# EAGLE design basic-inline-turbidimeter_power_board (EAGLE 7.7.0)
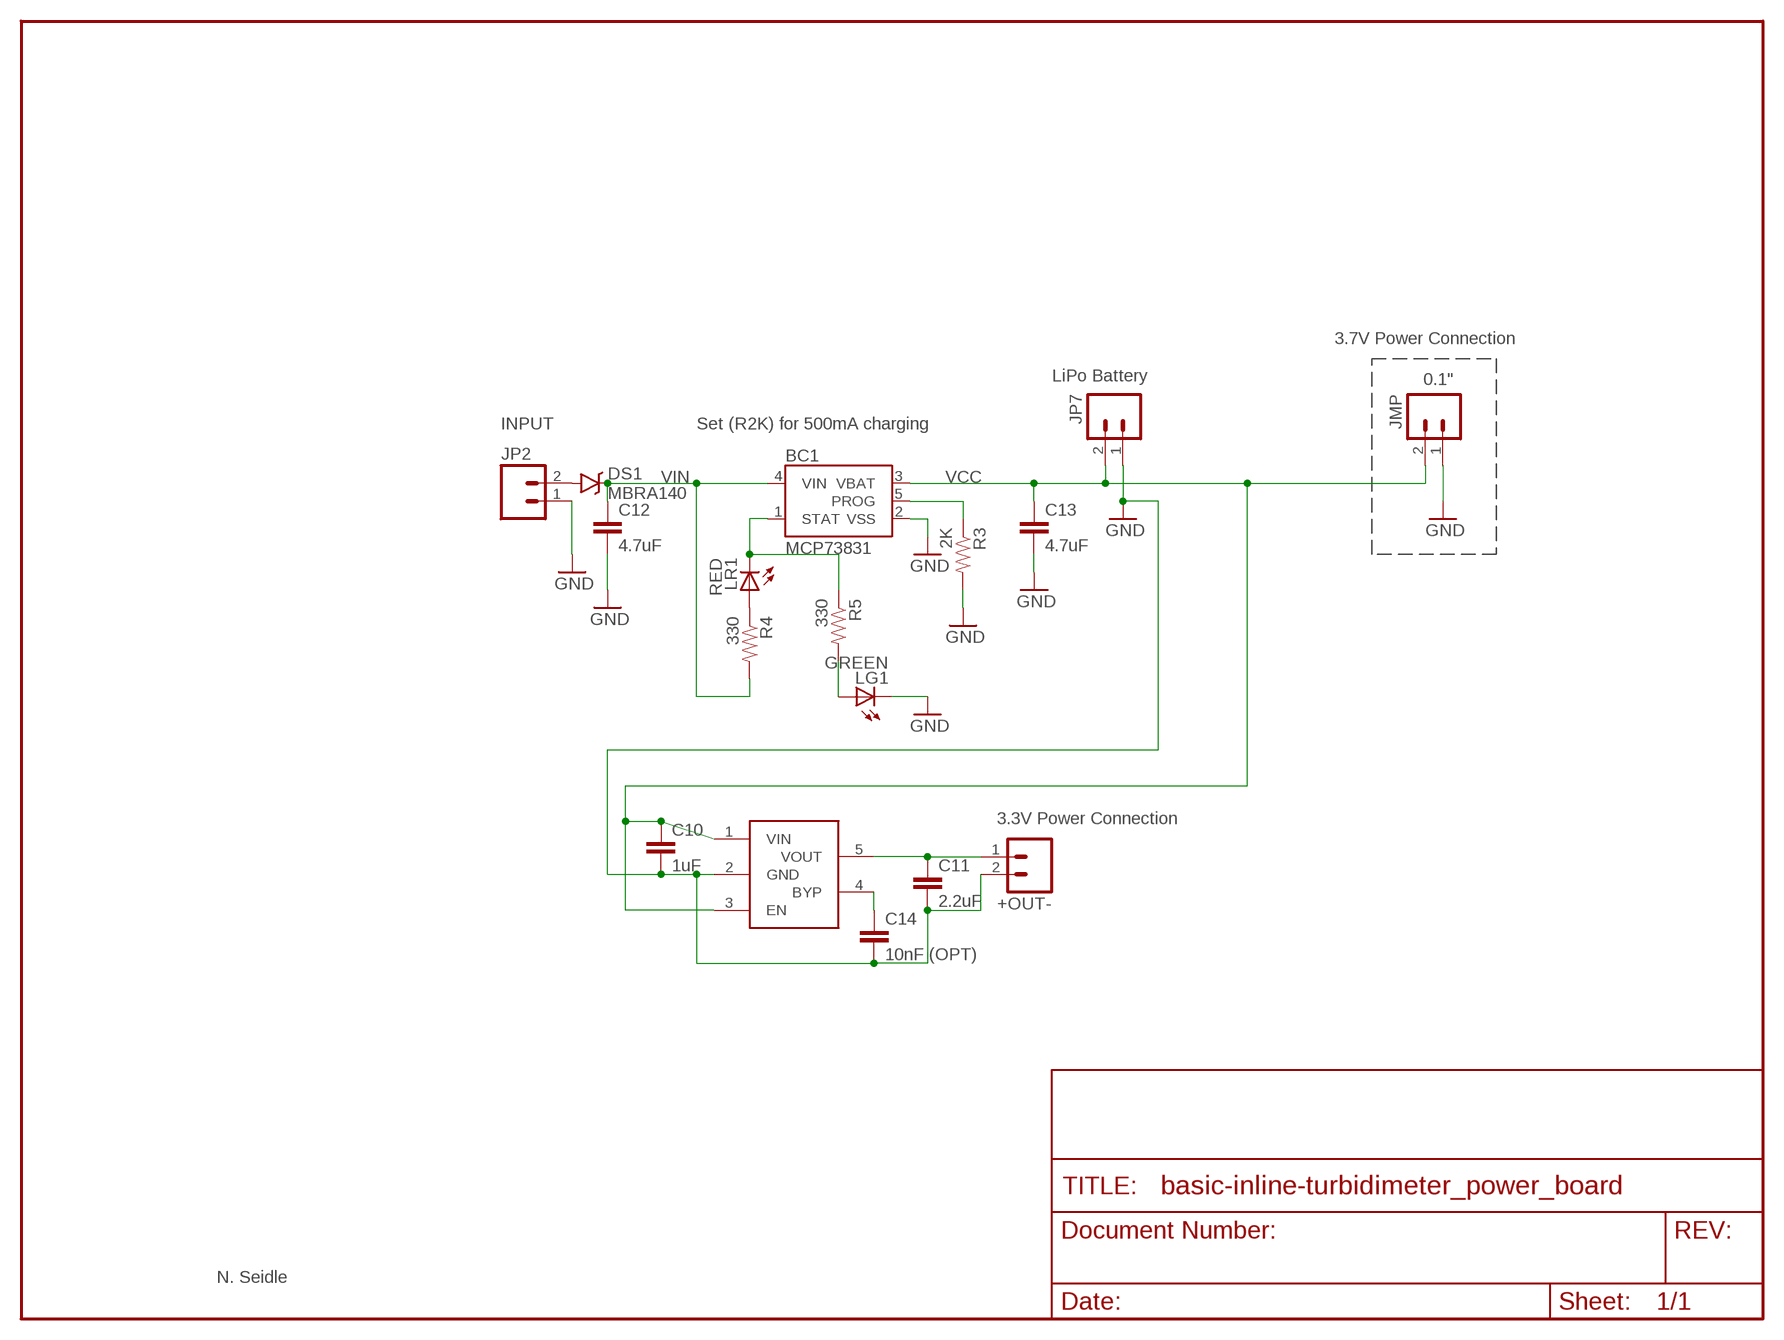
[diagram p0: schematic, sheet 1]

## Parts
+OUT-  M02PTH  [1X02]
BC1  MCP73831  [SOT23-5]
C10  1uF  CAP0603-CAP  [0603-CAP]
C11  2.2uF  CAP0603-CAP  [0603-CAP]
C12  4.7uF  CAP0402-CAP  [0402-CAP]
C13  4.7uF  CAP0402-CAP  [0402-CAP]
C14  10nF (OPT)  CAP0603-CAP  [0603-CAP]
DS1  MBRA140  [SMA-DIODE]
JMP  M02PTH  [1X02]
JP2  M02PTH  [1X02]
JP7  LiPo Battery  M02-JST-2MM-SMT  [JST-2-SMD]
LG1  GREEN  LED0603  [LED-0603]
LR1  RED  LED0603  [LED-0603]
R3  2K  RESISTOR0402-RES  [0402-RES]
R4  330  RESISTOR0402-RES  [0402-RES]
R5  330  RESISTOR0402-RES  [0402-RES]
VR1  LP2985  [LP2985]

## Nets
GND: +OUT-.2 BC1.2(VSS) C10.2 C11.2 C12.2 C13.2 C14.2 JMP.1 JP2.1 JP7.1 LG1.C R3.2 VR1.2(GND)
N$1: C14.1 VR1.4(BYP)
N$2: LG1.A R5.2
N$3: LR1.A R4.1
N$4: +OUT-.1 C11.1 VR1.5(VOUT)
N$5: DS1.A JP2.2
PROG: BC1.5(PROG) R3.1
STAT: BC1.1(STAT) LR1.C R5.1
VCC: BC1.3(VBAT) C10.1 C13.1 JMP.2 JP7.2 VR1.1(VIN) VR1.3(EN)
VIN: BC1.4(VIN) C12.1 DS1.C R4.2

## Notes on the sheet
- 3.7V Power Connection
- 0.1"
- INPUT | Set (R2K) for 500mA charging
- 3.3V Power Connection
- N. Seidle

## Library data of the parts
+OUT- JP2 = SparkFun-Connectors:M02: Standard 2-pin 0.1" header. Use with - straight break away headers ( PRT-00116) - right angle break away headers (PRT-00553) - swiss pins (PRT-00743) - machine pins (PRT-00117) - female headers (PRT-00115) Molex polarized connector foot print use with: PRT-08233 with associated crimp pins and housings. 2.54_SCREWTERM for use with PRT-10571. 3.5mm Screw Terminal footprints for PRT-08084 5mm Screw Terminal footprints for use with PRT-08432
BC1 = SparkFun:MCP73831: Microchip's MCP73831 Miniature single cell, fully integrated Li-Ion, Li-polymer charge management controller http://ww1.microchip.com/downloads/en/DeviceDoc/21984a.pdf
C10 C11 C14 = SparkFun-Passives:CAP: Capacitor Standard 0603 ceramic capacitor, and 0.1" leaded capacitor.
C12 C13 = SparkFun:CAP: Capacitor Standard 0603 ceramic capacitor, and 0.1" leaded capacitor.
DS1 = SparkFun-DiscreteSemi:MBRA140: 40V, 1A Schottky rectifier SMA/DO-214AC package DIO-08053; PROD_ID: DIO-08053
JMP JP7 = SparkFun:M02: Header 2 Standard 2-pin 0.1" header. Use with straight break away headers (SKU : PRT-00116), right angle break away headers (PRT-00553), swiss pins (PRT-00743), machine pins (PRT-00117), and female headers (PRT-00115). Molex polarized connector foot print use with SKU : PRT-08233 with associated crimp pins and housings.
LG1 LR1 = SparkFun:LED: LEDs Standard schematic elements and footprints for 5mm, 3mm, 1206, and 0603 sized LEDs. 5mm - Spark Fun Electronics SKU : COM-00529 (and others)
R3-R5 = SparkFun:RESISTOR: Resistor Basic schematic elements and footprints for 0603, 1206, and PTH resistors.
VR1 = awqua_eagle_library:LP2985

## Board
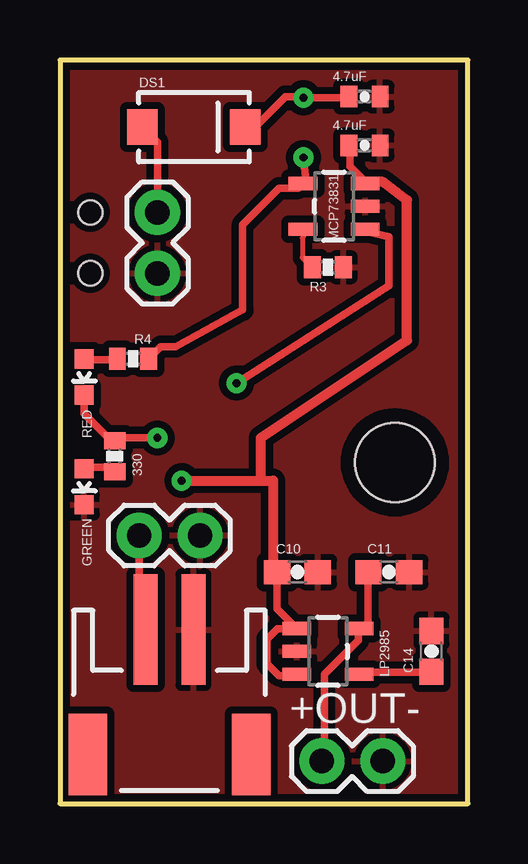
[diagram p1: board, top side]
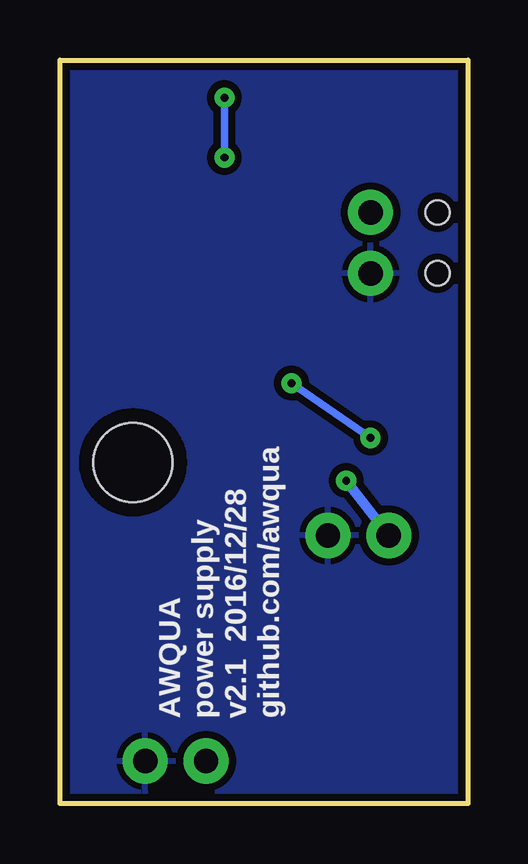
[diagram p2: board, bottom side, seen from below]

Size 17.02 x 30.99 mm. Coordinates in mm from the lower left corner, seen from the top.
Outline: 17.02,0 17.02,30.99 0,30.99 0,0 17.02,0
Copper layers (1*16): Top 0.035mm / dielectric 1.5mm / Bottom 0.035mm
Design rules "SparkFun": minimum track width 8mil, minimum drill 20mil, track to track 8mil, track to pad 8mil, pad to pad 8mil, via to via 8mil, smd to smd 6mil, copper to edge 8mil, drill to drill 8mil, minimum pad ring 12mil, minimum via ring 10mil, stop-mask expansion 4mil, vias tented up to drill 25mil, thermal gap 10mil
Holes 1.02 mm at 1.27,24.64 1.27,22.1

### Footprints (pad centres in the part's own frame; a part is rotated, then mirrored left to right if it is on the bottom)
1X02 = drill 1.016 pad 1.88: 1 0,0; 2 2.54,0
SOT23-5 = smd 0.55 x 1.2: 1 -0.95,-1.3; 2 0,-1.3; 3 0.95,-1.3; 4 0.95,1.3; 5 -0.95,1.3
0603-CAP = smd 1.1 x 1: 1 -0.85,0; 2 0.85,0
0402-CAP = smd 0.7 x 0.9: 1 -0.65,0; 2 0.65,0
SMA-DIODE = smd 1.27 x 1.47: A -2.15,0; C 2.15,0
STAND-OFF = hole 3.302: 0,0
JST-2-SMD = smd 1 x 4.6: 1 -1,-3.7; 2 1,-3.7 | smd 1.6 x 3.4: NC1 -3.4,1.5; NC2 3.4,1.5
LED-0603 = smd 0.8 x 0.8: A 0,-0.75; C 0,0.75
0402-RES = smd 0.7 x 0.9: 1 -0.65,0; 2 0.65,0
LP2985 = smd 0.55 x 1.2: 1 0.32,-0.03; 2 1.27,-0.03; 3 2.22,-0.03; 4 2.22,2.57; 5 0.32,2.57

### Placement (x,y rotation side)
+OUT-  10.92,1.78 0 top
BC1  11.43,24.89 90 top
C10  9.91,9.65 0 top
C11  13.72,9.65 0 top
C12  12.7,29.46 0 top
C13  12.7,27.43 0 top
C14  15.49,6.35 90 top
DS1  5.59,28.19 0 top
JMP  5.84,11.18 180 top
JP1  STAND-OFF  [STAND-OFF]  13.97,14.22 0 top
JP2  4.06,22.1 90 top
JP7  4.57,3.56 180 top
LG1  1.02,13.21 180 top
LR1  1.02,17.78 180 top
R3  11.18,22.35 0 top
R4  3.05,18.54 0 top
R5  2.29,14.48 270 top
VR1  9.91,7.62 270 top

### Tracks (layer width: path | path; a pad name or v marks a point on that pad's centre or on a via)
GND
  pour Bottom (isolate 0.305): -2.79,-1.52 -3.05,31.5 29.46,31.24 29.46,-0.25
  pour Top (isolate 0.305): -3.56,31.75 28.96,31.24 28.96,-0.51 -3.3,-1.02
N$1
  Top 0.203: 15.49,5.49 C14.1 | 12.65,5.49 VR1.4
  Top 0.305: 12.65,5.49 15.49,5.49
N$2
  Top 0.203: 1.07,14.02 LG1.A | 2.29,14.02 R5.2
  Top 0.305: 2.29,14.02 1.07,14.02
N$3
  Top 0.203: 1.07,18.49 LR1.A | 2.29,18.49 R4.1
  Top 0.305: 2.29,18.49 1.07,18.49
N$4
  Top 0.203: 12.85,7.52 12.65,7.32 VR1.5 12.45,7.11 | 12.85,9.55 C11.1 | 11.02,1.83 +OUT-.1
  Top 0.305: 12.85,7.52 12.85,9.55 | 12.45,7.11 12.45,6.81 11.02,5.38 11.02,1.83
N$5
  Top 0.305: JP2.2 4.06,27.57 DS1.A
PROG
  Top 0.203: R3.1 10.11,22.76 10.11,23.57 10.26,23.93 BC1.5
STAT  (via drill 0.33)
  Top 0.305: LR1.C 1.02,16.26 2.14,15.13 R5.1 2.4,15.24 v4.06,15.24 | BC1.1 12.73,23.85 13.72,23.62 13.72,21.59 v7.37,17.53
  Bottom 0.305: v7.37,17.53 v4.06,15.24
VCC  (via drill 0.33)
  Top 0.203: 12.09,27.58 C13.1 | 12.7,25.96 BC1.3
  Top 0.305: 12.09,27.58 12.09,26.57 12.7,25.96 | C10.1 9.06,8.12 VR1.1 9.08,7.3 8.64,6.86 8.64,5.84 9.14,5.33 9.81,5.33 VR1.3 | JMP.2 3.3,7.53 JP7.2
  Top 0.406: v5.08,13.46 8.38,13.46 | 8.38,13.46 8.89,13.46 8.89,9.82 C10.1 | 8.38,13.46 8.38,15.24 14.48,19.3 14.48,25.15 13.46,25.91 12.8,25.91 BC1.3
  Bottom 0.406: JMP.2 v5.08,13.46
VIN  (via drill 0.33)
  Top 0.203: 11.89,29.41 C12.1 | 10.26,25.96 BC1.4
  Top 0.305: 11.89,29.41 v10.16,29.41 10.11,29.46 9.4,29.46 8.13,28.19 DS1.C | 10.26,25.96 v10.16,26.92 | BC1.4 9.94,25.65 9.14,25.65 7.62,24.13 7.62,20.57 4.83,19.05 4.21,19.05 R4.2
  Bottom 0.305: v10.16,26.92 v10.16,29.41

### Text on the board
bPlace: AWQUA / power supply / v2.1 2016/12/28 / github.com/awqua